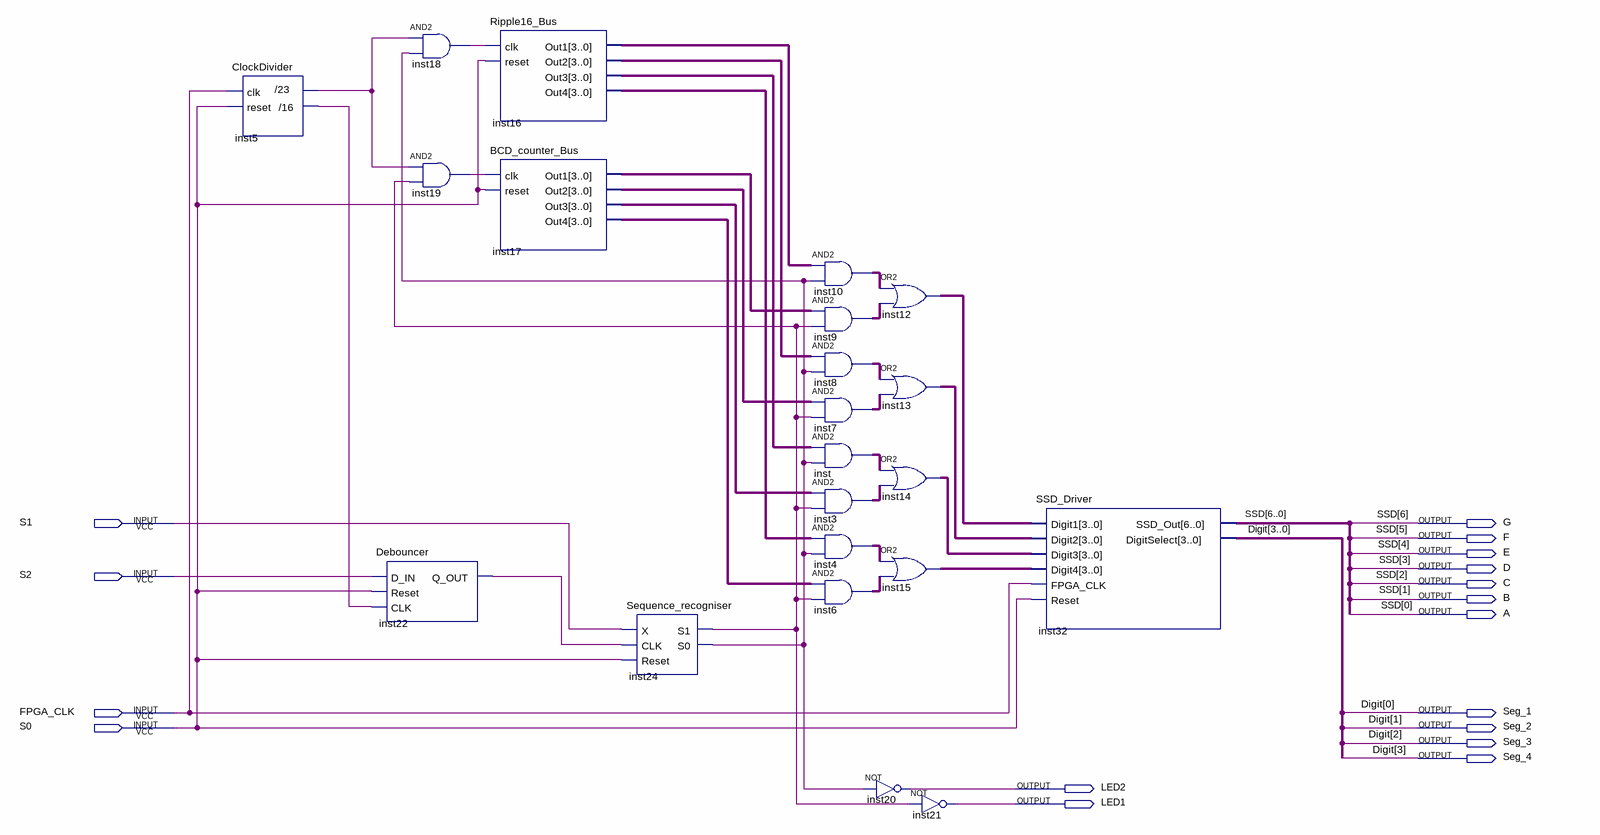
[diagram p0: schematic sheet]
// Quartus schematic Lab4b.bdf as structural Verilog: 22 symbols, 17 pins
module Lab4b (
  input  S1,
  input  S2,
  input  FPGA_CLK,
  input  S0,
  output G,
  output F,
  output E,
  output D,
  output C,
  output B,
  output A,
  output Seg_1,
  output Seg_2,
  output Seg_3,
  output Seg_4,
  output LED2,
  output LED1
);

  wire inst5__16, inst5__23, inst18_out, inst19_out, inst22_q_out, inst24_s0, inst24_s1;
  wire [3:0] inst3_out, inst4_out, inst6_out, inst7_out, inst8_out, inst9_out, inst10_out, inst12_out,
       inst13_out, inst14_out, inst15_out, inst16_out1, inst16_out2, inst16_out3, inst16_out4, inst17_out1,
       inst17_out2, inst17_out3, inst17_out4, inst_out;

  ClockDivider inst5 (.clk(FPGA_CLK), .reset(S0), .\/16 (inst5__16), .\/23 (inst5__23));
  and inst18 (inst18_out, inst5__23, inst24_s0);
  and inst19 (inst19_out, inst5__23, inst24_s1);
  Debouncer inst22 (.D_IN(S2), .Reset(S0), .CLK(inst5__16), .Q_OUT(inst22_q_out));
  Ripple16_Bus inst16 (
    .clk(inst18_out), .reset(S0), .Out1(inst16_out1), .Out2(inst16_out2), .Out3(inst16_out3),
    .Out4(inst16_out4));
  BCD_counter_Bus inst17 (
    .clk(inst19_out), .reset(S0), .Out1(inst17_out1), .Out2(inst17_out2), .Out3(inst17_out3),
    .Out4(inst17_out4));
  Sequence_recogniser inst24 (.X(S1), .CLK(inst22_q_out), .Reset(S0), .S1(inst24_s1), .S0(inst24_s0));
  assign inst10_out = inst16_out1 & {4{inst24_s0}};  // AND2 inst10, 4 bits wide
  assign inst9_out = inst17_out1 & {4{inst24_s1}};  // AND2 inst9, 4 bits wide
  assign inst8_out = inst16_out2 & {4{inst24_s0}};  // AND2 inst8, 4 bits wide
  assign inst7_out = inst17_out2 & {4{inst24_s1}};  // AND2 inst7, 4 bits wide
  assign inst_out = inst16_out3 & {4{inst24_s0}};  // AND2 inst, 4 bits wide
  assign inst3_out = inst17_out3 & {4{inst24_s1}};  // AND2 inst3, 4 bits wide
  assign inst4_out = inst16_out4 & {4{inst24_s0}};  // AND2 inst4, 4 bits wide
  assign inst6_out = inst17_out4 & {4{inst24_s1}};  // AND2 inst6, 4 bits wide
  assign inst12_out = inst10_out | inst9_out;  // OR2 inst12, 4 bits wide
  assign inst13_out = inst8_out | inst7_out;  // OR2 inst13, 4 bits wide
  assign inst14_out = inst_out | inst3_out;  // OR2 inst14, 4 bits wide
  assign inst15_out = inst4_out | inst6_out;  // OR2 inst15, 4 bits wide
  not inst20 (LED2, inst24_s0);
  not inst21 (LED1, inst24_s1);
  SSD_Driver inst32 (
    .Digit1(inst12_out), .Digit2(inst13_out), .Digit3(inst14_out), .Digit4(inst15_out), .FPGA_CLK(FPGA_CLK),
    .Reset(S0), .SSD_Out({G, F, E, D, C, B, A}), .DigitSelect({Seg_4, Seg_3, Seg_2, Seg_1}));

  // Other names for the same wires on the sheet: Digit[3:0] = {Seg_4, Seg_3, Seg_2, Seg_1};
  //   SSD[6:0] = {G, F, E, D, C, B, A}
endmodule
